# EAGLE schematic Memory Display (EAGLE 7.7.0)
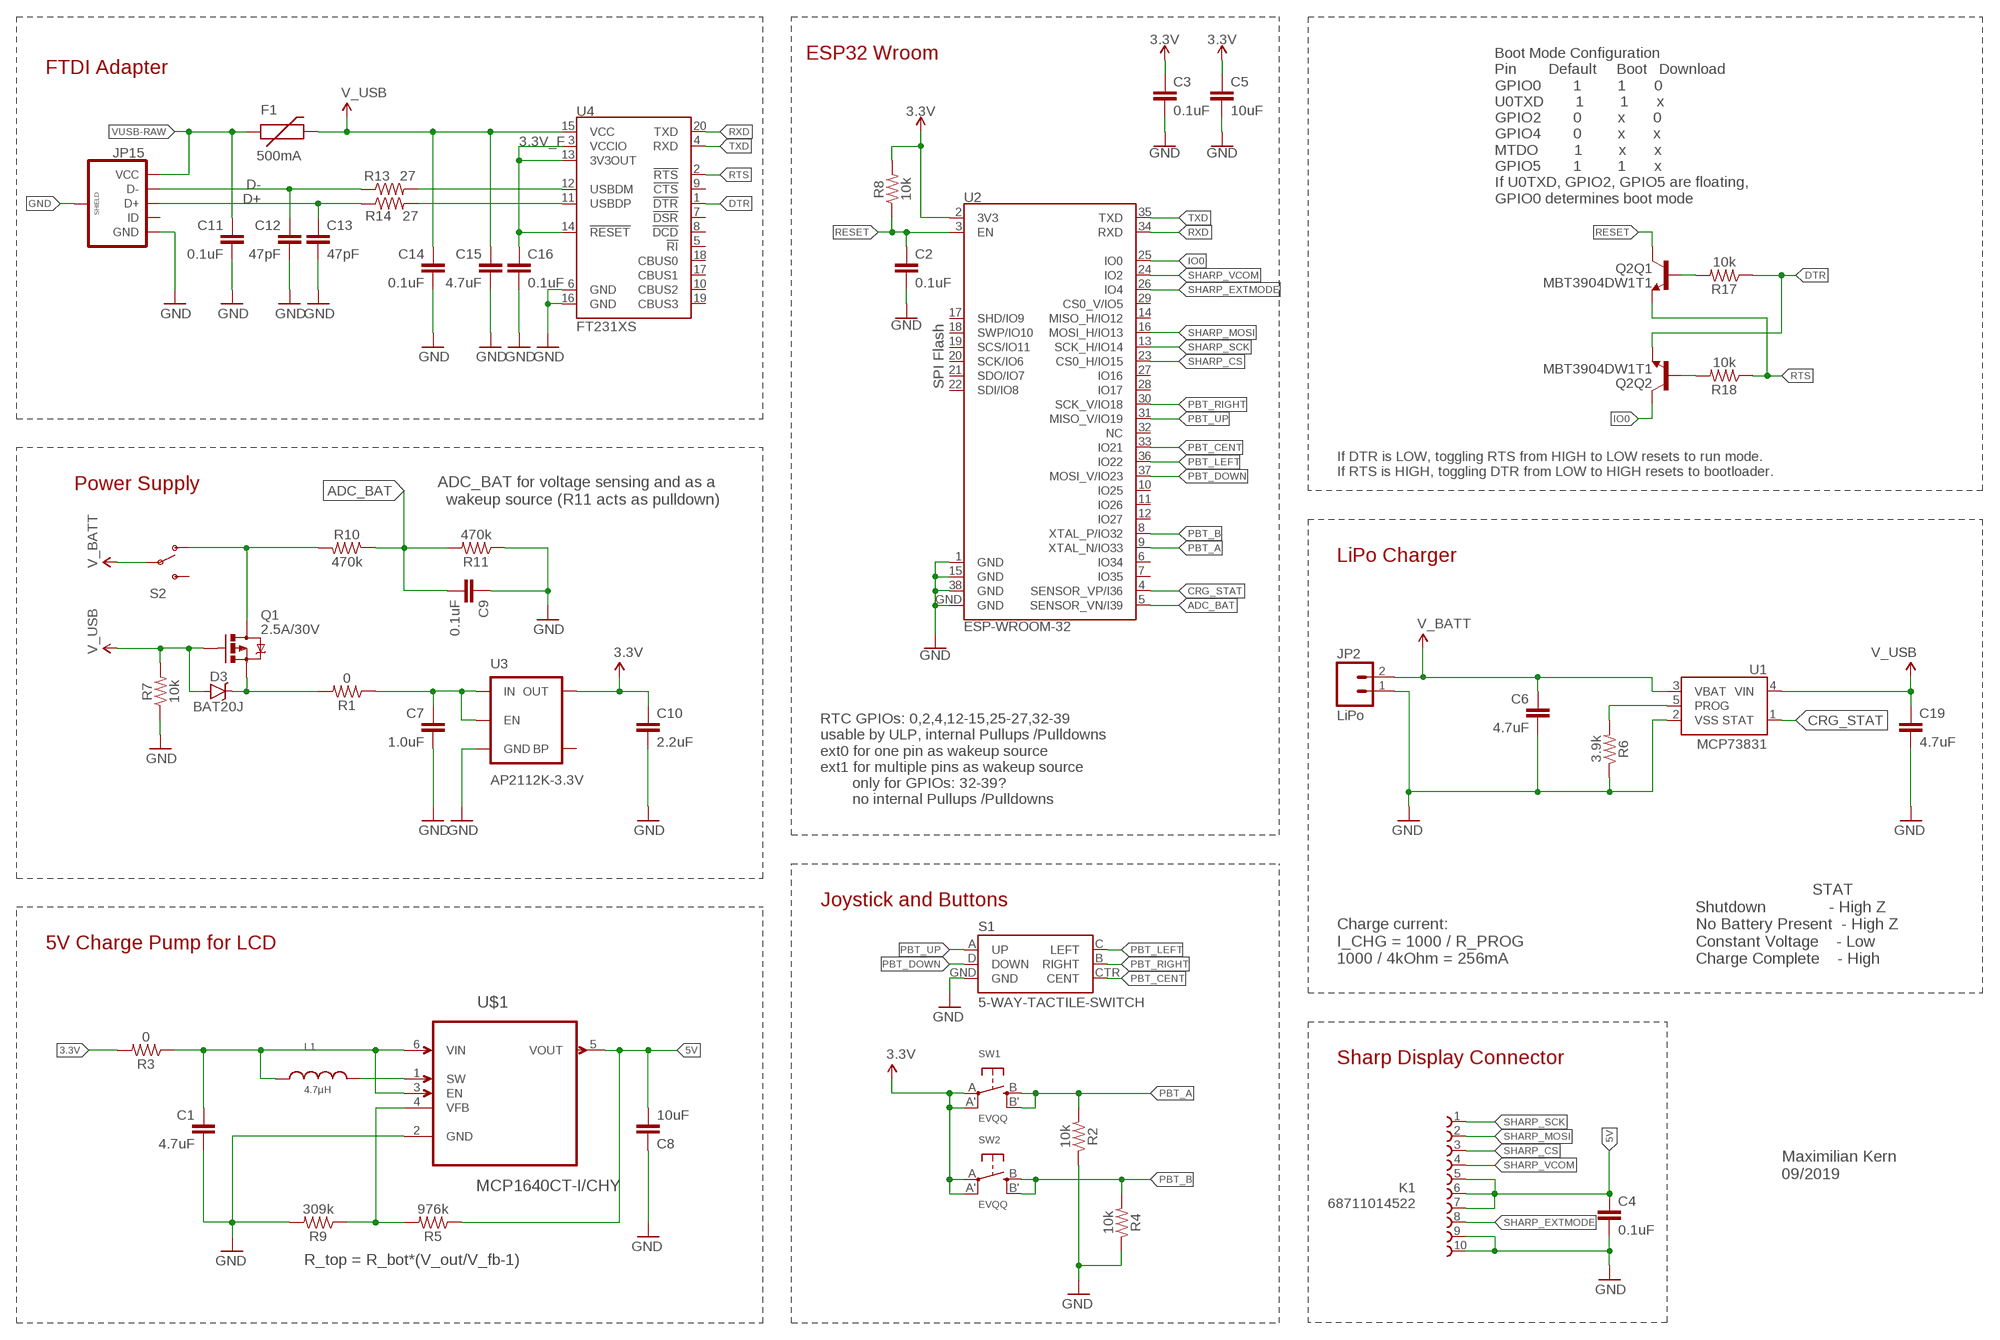
[diagram p0: schematic, sheet 1]

## Parts
C1  4.7uF  47PF-0603-50V-5%  [0603]
C2  0.1uF  0.1UF-0603-25V-(+80/-20%)  [0603]
C3  0.1uF  0.1UF-0603-25V-(+80/-20%)  [0603]
C4  0.1uF  0.1UF-0603-25V-(+80/-20%)  [0603]
C5  10uF  10UF-0603-6.3V-20%  [0603]
C6  4.7uF  4.7UF0603  [0603]
C7  1.0uF  1.0UF-0805-25V-(+80/-20%)  [0805]
C8  10uF  47PF-0603-50V-5%  [0603]
C9  0.1uF  0.1UF-0603-25V-(+80/-20%)  [0603]
C10  2.2uF  1.0UF-0805-25V-(+80/-20%)  [0805]
C11  0.1uF  0.1UF-0603-25V-(+80/-20%)  [0603]
C12  47pF  47PF-0603-50V-5%  [0603]
C13  47pF  47PF-0603-50V-5%  [0603]
C14  0.1uF  0.1UF-0603-25V-(+80/-20%)  [0603]
C15  4.7uF  4.7UF-6.3V-10%(0603)0603  [0603-CAP]
C16  0.1uF  0.1UF-0603-25V-(+80/-20%)  [0603]
C19  4.7uF  4.7UF0603  [0603]
D3  BAT20J  DIODE-SCHOTTKY-BAT20J  [SOD-323]
F1  500mA  PTCSMD  [PTC-1206]
JP2  LiPo  M02JST-PTH-2  [JST-2-PTH]
JP15  USB_MICROB_PLUGCONN-11752  [USB-B-MICRO-SMD_V03]
K1  68711014522  [68711014522]
L1  4.7µH  WE-TPC_2813_744029004  [WE-TPC_2811/2813_OLD]
Q1  2.5A/30V  MOSFET-PCHANNELDMG2307L  [SOT23-3]
Q2  MBT3904DW1T1  [SC70-6]
R1  0  10KOHM-0603-1/10W-1%  [0603]
R2  10k  10KOHM-0603-1/10W-1%  [0603]
R3  0  10KOHM-0603-1/10W-1%  [0603]
R4  10k  10KOHM-0603-1/10W-1%  [0603]
R5  976k  10KOHM-0603-1/10W-1%  [0603]
R6  3.9k  2.0KOHM1/10W5%(0603)  [0603]
R7  10k  10KOHM-0603-1/10W-1%  [0603]
R8  10k  10KOHM-0603-1/10W-1%  [0603]
R9  309k  10KOHM-0603-1/10W-1%  [0603]
R10  470k  10KOHM-0603-1/10W-1%  [0603]
R11  470k  10KOHM-0603-1/10W-1%  [0603]
R13  27  27OHM1/10W1%(0603)0603-RES  [0603]
R14  27  27OHM1/10W1%(0603)0603-RES  [0603]
R17  10k  10KOHM-0603-1/10W-1%  [0603]
R18  10k  10KOHM-0603-1/10W-1%  [0603]
S1  5-WAY-TACTILE-SWITCH  JOYSTICK_MINI  [JOYSTICK_MINI]
S2  SWITCH-SPDT-SMD-A  [SWITCH-SPST-SMD-A]
SW1  EVQQ  SWITCH_TACT_SMT_EVQQ2_SMALL  [EVQ-Q2_SMALLER]
SW2  EVQQ  SWITCH_TACT_SMT_EVQQ2_SMALL  [EVQ-Q2_SMALLER]
U1  MCP73831  [SOT23-5]
U2  ESP-WROOM-32  [ESP-WROOM-32]
U3  AP2112K-3.3V  V_REG_LDOSMD  [SOT23-5]
U4  FT231XS  [SSOP20_L]
U$1  MCP1640CT-I/CHY  [SOT95P270X145-6N]

## Nets
3.3V: C3.1 C5.1 C10.1 R3.2 R8.2 SW1.A'(P1) SW1.A(P) SW2.A'(P1) SW2.A(P) U2.2(3V3) U3.5(OUT)
3.3V_F: C16.1 U4.3(VCCIO) U4.13(3V3OUT) U4.14(!RESET)
5V: C4.1 C8.2 K1.5 K1.6 K1.7 R5.1 U$1.5(VOUT)
ADC_BAT: C9.2 R10.1 R11.2 U2.5(SENSOR_VN/I39)
B_VFB: R5.2 R9.1 U$1.4(VFB)
CRG_STAT: U1.1(STAT) U2.4(SENSOR_VP/I36)
D+: C13.1 JP15.D+ R14.1
D-: C12.1 JP15.D- R13.1
DTR: Q2.1(Q2:E) R17.1 U4.1(!DTR)
GND: C1.2 C2.2 C3.2 C4.2 C5.2 C6.2 C7.2 C8.1 C9.1 C10.2 C11.2 C12.2 C13.2 C14.2 C15.2 C16.2 C19.2 JP2.1 JP15.GND JP15.SHIELD1(SHIELD) JP15.SHIELD2(SHIELD) JP15.SHIELD3(SHIELD) K1.9 K1.10 R2.1 R4.1 R6.1 R7.1 R9.2 R11.1 S1.GND U1.2(VSS) U2.1(GND) U2.15(GND) U2.38(GND) U2.GND U3.2(GND) U4.6(GND) U4.16(GND) U$1.2(GND)
IO0: Q2.6(Q2:C) U2.25(IO0)
N$1: C1.1 L1.1 R3.1 U$1.3(EN) U$1.6(VIN)
N$2: L1.2 U$1.1(SW)
N$3: C7.1 R1.1 U3.1(IN) U3.3(EN)
N$4: Q1.3(D) R10.2 S2.1(O)
N$5: D3.C Q1.2(S) R1.2
N$7: R13.2 U4.12(USBDM)
N$8: R14.2 U4.11(USBDP)
N$10: Q2.5(Q1:B) R17.2
N$12: Q2.2(Q2:B) R18.2
N$16: R6.2 U1.5(PROG)
PBT_A: R2.2 SW1.B'(S1) SW1.B(S) U2.9(XTAL_N/IO33)
PBT_B: R4.2 SW2.B'(S1) SW2.B(S) U2.8(XTAL_P/IO32)
PBT_CENT: S1.CTR(CENT) U2.33(IO21)
PBT_DOWN: S1.D(DOWN) U2.37(MOSI_V/IO23)
PBT_LEFT: S1.C(LEFT) U2.36(IO22)
PBT_RIGHT: S1.B(RIGHT) U2.30(SCK_V/IO18)
PBT_UP: S1.A(UP) U2.31(MISO_V/IO19)
RESET: C2.1 Q2.3(Q1:C) R8.1 U2.3(EN)
RTS: Q2.4(Q1:E) R18.1 U4.2(!RTS)
RXD: U2.34(RXD) U4.20(TXD)
SHARP_CS: K1.3 U2.23(CS0_H/IO15)
SHARP_EXTMODE: K1.8 U2.26(IO4)
SHARP_MOSI: K1.2 U2.16(MOSI_H/IO13)
SHARP_SCK: K1.1 U2.13(SCK_H/IO14)
SHARP_VCOM: K1.4 U2.24(IO2)
TXD: U2.35(TXD) U4.4(RXD)
V_BATT: C6.1 JP2.2 S2.2(P) U1.3(VBAT)
V_USB: C14.1 C15.1 C19.1 D3.A F1.2 Q1.1(G) R7.2 U1.4(VIN) U4.15(VCC)
VUSB-RAW: C11.1 F1.1 JP15.VBUS(VCC)
Unconnected: JP15.ID S2.3(S) U2.6(IO34) U2.7(IO35) U2.10(IO25) U2.11(IO26) U2.12(IO27) U2.14(MISO_H/IO12) U2.17(SHD/IO9) U2.18(SWP/IO10) U2.19(SCS/IO11) U2.20(SCK/IO6) U2.21(SDO/IO7) U2.22(SDI/IO8) U2.27(IO16) U2.28(IO17) U2.29(CS0_V/IO5) U2.32(NC) U3.4(BP) U4.5(!RI) U4.7(!DSR) U4.8(!DCD) U4.9(!CTS) U4.10(CBUS2) U4.17(CBUS1) U4.18(CBUS0) U4.19(CBUS3)

## Notes on the sheet
- ESP32 Wroom
- FTDI Adapter
- Boot Mode Configuration
  Pin        Default     Boot   Download
  GPIO0        1         1       0
  U0TXD        1         1       x
  GPIO2        0         x       0
  GPIO4        0         x       x
  MTDO         1         x       x
  GPIO5        1         1       x
  If U0TXD, GPIO2, GPIO5 are floating, 
  GPIO0 determines boot mode
- SPI Flash
- Power Supply
- ADC_BAT for voltage sensing and as a 
  wakeup source (R11 acts as pulldown)
- If DTR is LOW, toggling RTS from HIGH to LOW resets to run mode.
  If RTS is HIGH, toggling DTR from LOW to HIGH resets to bootloader.
- LiPo Charger
- RTC GPIOs: 0,2,4,12-15,25-27,32-39
  usable by ULP, internal Pullups /Pulldowns
  ext0 for one pin as wakeup source
  ext1 for multiple pins as wakeup source
          only for GPIOs: 32-39?
          no internal Pullups /Pulldowns
- Joystick and Buttons
- 5V Charge Pump for LCD
- Charge current:
  I_CHG = 1000 / R_PROG
  1000 / 4kOhm = 256mA
- STAT
  Shutdown              - High Z 
  No Battery Present  - High Z 
  Constant Voltage    - Low
  Charge Complete    - High
- Sharp Display Connector
- Maximilian Kern
  09/2019
- R_top = R_bot*(V_out/V_fb-1)

## Library data of the parts
C1 C8 = SparkFun-Capacitors:47PF: 47pF ceramic capacitors A capacitor is a passive two-terminal electrical component used to store electrical energy temporarily in an electric field.; PROD_ID: CAP-08913; VALUE: 47pF
C2-C4 C9 C11 C14 C16 = SparkFun-Capacitors:0.1UF: 0.1µF ceramic capacitors A capacitor is a passive two-terminal electrical component used to store electrical energy temporarily in an electric field.; PROD_ID: CAP-00810
C5 = SparkFun-Capacitors:10UF: 10.0µF ceramic capacitors A capacitor is a passive two-terminal electrical component used to store electrical energy temporarily in an electric field.; PROD_ID: CAP-11015
C6 C19 = SparkFun-Capacitors:4.7UF: 4.7µF ceramic capacitors A capacitor is a passive two-terminal electrical component used to store electrical energy temporarily in an electric field.; PROD_ID: CAP-08280
C7 = SparkFun-Capacitors:1.0UF: 1µF ceramic capacitors A capacitor is a passive two-terminal electrical component used to store electrical energy temporarily in an electric field.; PROD_ID: CAP-11625
C10 = SparkFun-Capacitors:1.0UF: 1µF ceramic capacitors A capacitor is a passive two-terminal electrical component used to store electrical energy temporarily in an electric field.; PROD_ID: CAP-11625; VALUE: 1.0uF
C12 C13 = SparkFun-Capacitors:47PF: 47pF ceramic capacitors A capacitor is a passive two-terminal electrical component used to store electrical energy temporarily in an electric field.; PROD_ID: CAP-08913
C15 = SparkFun-Capacitors:4.7UF-6.3V-10%(0603): CAP-08280; PROD_ID: CAP-08280
D3 = SparkFun-DiscreteSemi:DIODE-SCHOTTKY: Schottky diodes in SFE's production catalog BAT20J 1A 23V 0.62Vf RB751 120mA 40V 0.37Vf PMEG4005EJ 0.5A 40V 0.42Vf MBRA140 1A 40V 0.5Vf B340A 3A 40V SMA; PROD_ID: DIO-11623
F1 = SparkFun-PowerIC:PTC: Resettable Fuse PTC Resettable Fuse. Spark Fun Electronics SKU : COM-08357; PROD_ID: RES-11150
JP2 = SparkFun-Connectors:M02: Standard 2-pin 0.1" header. Use with - straight break away headers ( PRT-00116) - right angle break away headers (PRT-00553) - swiss pins (PRT-00743) - machine pins (PRT-00117) - female headers (PRT-00115) Molex polarized connector foot print use with: PRT-08233 with associated crimp pins and housings. 2.54_SCREWTERM for use with PRT-10571. 3.5mm Screw Terminal footprints for PRT-08084 5mm Screw Terminal footprints for use with PRT-08432; PROD_ID: CONN-09863; SKU: PRT-09914
JP15 = SparkFun-Connectors:USB_MICROB_PLUG: USB Micro-B connectors Some male, some female. Watch your step!; PROD_ID: CONN-11752
K1 = Eagle_FPC_CONNECTOR_AND_FFC_CAB_rev15c:68711014522: WR-FPC 0.5mm SMT ZIF Horizontal Bottom Contact, 10 Pins=>Code : Con_FPC_ZIF_0.50_68711014522 <http://katalog.we-online.de/media/images/eican/Con_FPC_ZIF_0.50_6871xx14522_pf2.jpg> Details see: http://katalog.we-online.de/en/em/687_1xx_145_22 Created 2014-07-09, Karrer Zheng 2014 (C) Würth Elektronik
L1 = EMCComponents (rev19e):WE-TPC_2813: SMD Shielded Tiny Power Inductor Characteristics Extremely flat power inductor High current capability Magnetically shielded which results in a low leakage field Operating temperature: –40 °C to +125 °C Applications Portable power like PDA, digital camera, PCMCIA cards and displays DC/DC converter Embedded PC Mobile data gathering, telemetric <http://katalog.we-online.de/media/images/v2/WE-TPC_Gruppe_2.jpg> Details see: http://katalog.we-online.de/en/pbs/WE-TPC? Updated by Dan Xu 2014-07-11 2014 (C) Wurth Elektronik; WE-NUMBER: 744029004/4,7uH
Q1 = SparkFun-DiscreteSemi:MOSFET-PCHANNEL: Generic PMOSFET IRLML2244 - TRANS-11153 (SOT-23 -20V -4.3A) (1.Gate 2.Source 3.Drain) FQP27P06 - COM-10349 <http://www.sparkfun.com/products/10349> (TO-220 -60V -27A) (1.Gate 2.Source 3.Drain); PROD_ID: TRANS-11308
Q2 = esp32-thing-temp:MBT3904DW1T1: MBT3904DW1 Dual NPN Transistors The MBT3904W1 puts two general purpose 3904 NPN transistors in a single package. Datasheet <http://www.onsemi.com/pub_link/Collateral/MBT3904DW1T1-D.PDF>; PROD_ID: TRANS-13337
R1 R3 R5 R9-R11 = SparkFun-Resistors:10KOHM: 10kΩ resistor A resistor is a passive two-terminal electrical component that implements electrical resistance as a circuit element. Resistors act to reduce current flow, and, at the same time, act to lower voltage levels within circuits. - Wikipedia; PROD_ID: RES-00824; VALUE: 10k
R2 R4 R7 R8 R17 R18 = SparkFun-Resistors:10KOHM: 10kΩ resistor A resistor is a passive two-terminal electrical component that implements electrical resistance as a circuit element. Resistors act to reduce current flow, and, at the same time, act to lower voltage levels within circuits. - Wikipedia; PROD_ID: RES-00824
R6 = SparkFun-Resistors:2.0KOHM1/10W5%(0603): RES-08296; PROD_ID: RES-08296; VALUE: 2.0k
R13 R14 = SparkFun-Resistors:27OHM1/10W1%(0603): RES-09334; PROD_ID: RES-09334
S1 = SparkFun-Electromechanical:JOYSTICK_MINI: Small 5-way tactile joystick, COM-10063 4UCON SF303GJ26
S2 = SparkFun-Electromechanical:SWITCH-SPDT: SPDT Switch Simple slide switch, Spark Fun Electronics SKU : COM-00102 DPDT SMT slide switch, AYZ0202, SWCH-08179; PROD_ID: SWCH-10651
SW1 SW2 = microbuilder:SWITCH_TACT_SMT: SMT Tact Switches 6x6mm - Digikey: P12940SCT-ND KMR2 (4.6x2.8mm) - Digikey: 401-1426-1-ND EVQ-PQHB55 - Light Touch, 160GF (4.5x4.5mm) - Digikey: P8090SCT-ND KMT0 - KMT021 NGJ LHS (etc.) IP68/Waterproof - Digikey: CKN10289CT-ND
U1 = SparkFun-PowerIC:MCP73831: Miniature single cell, fully integrated Li-Ion, Li-polymer charge management controller http://ww1.microchip.com/downloads/en/DeviceDoc/20001984g.pdf IC-09995; PROD_ID: IC-09995
U2 = SparkFun-RF:ESP-WROOM-32; PROD_ID: IC-13849
U3 = SparkFun-PowerIC:V_REG_LDO: Voltage Regulator LDO Standard 150mA LDO voltage regulator in SOT-23 layout. Micrel part MIC5205. BP (by-pass) pin is used to lower output noise with 470pF cap.; PROD_ID: VREG-12457
U4 = SparkFun-DigitalIC:FT231X: FTDI FT231X Full Speed USB to Full-handshake UART This USB2.0 Full Speed IC offers a compact bridge to full handshake UART interfaces. The device is a UART, capable of operating up to 3MBaud, with low power consumption (8mA). The FT231X includes the complete FT-X series feature set and enables USB to be added into a system design quickly and easily over a UART interface.; PROD_ID: IC-11524
U$1 = Microchip_By_element14_Batch_1:MCP1640CT-I/CHY: Synchronous Boost Regulator; MPN: MCP1640CT-I/CHY; OC_FARNELL: 1800208; OC_NEWARK: 73R3626; PACKAGE: SOT-6; SUPPLIER: Microchip